# EAGLE design Esquema 02 guilherme (EAGLE 9.6.2)
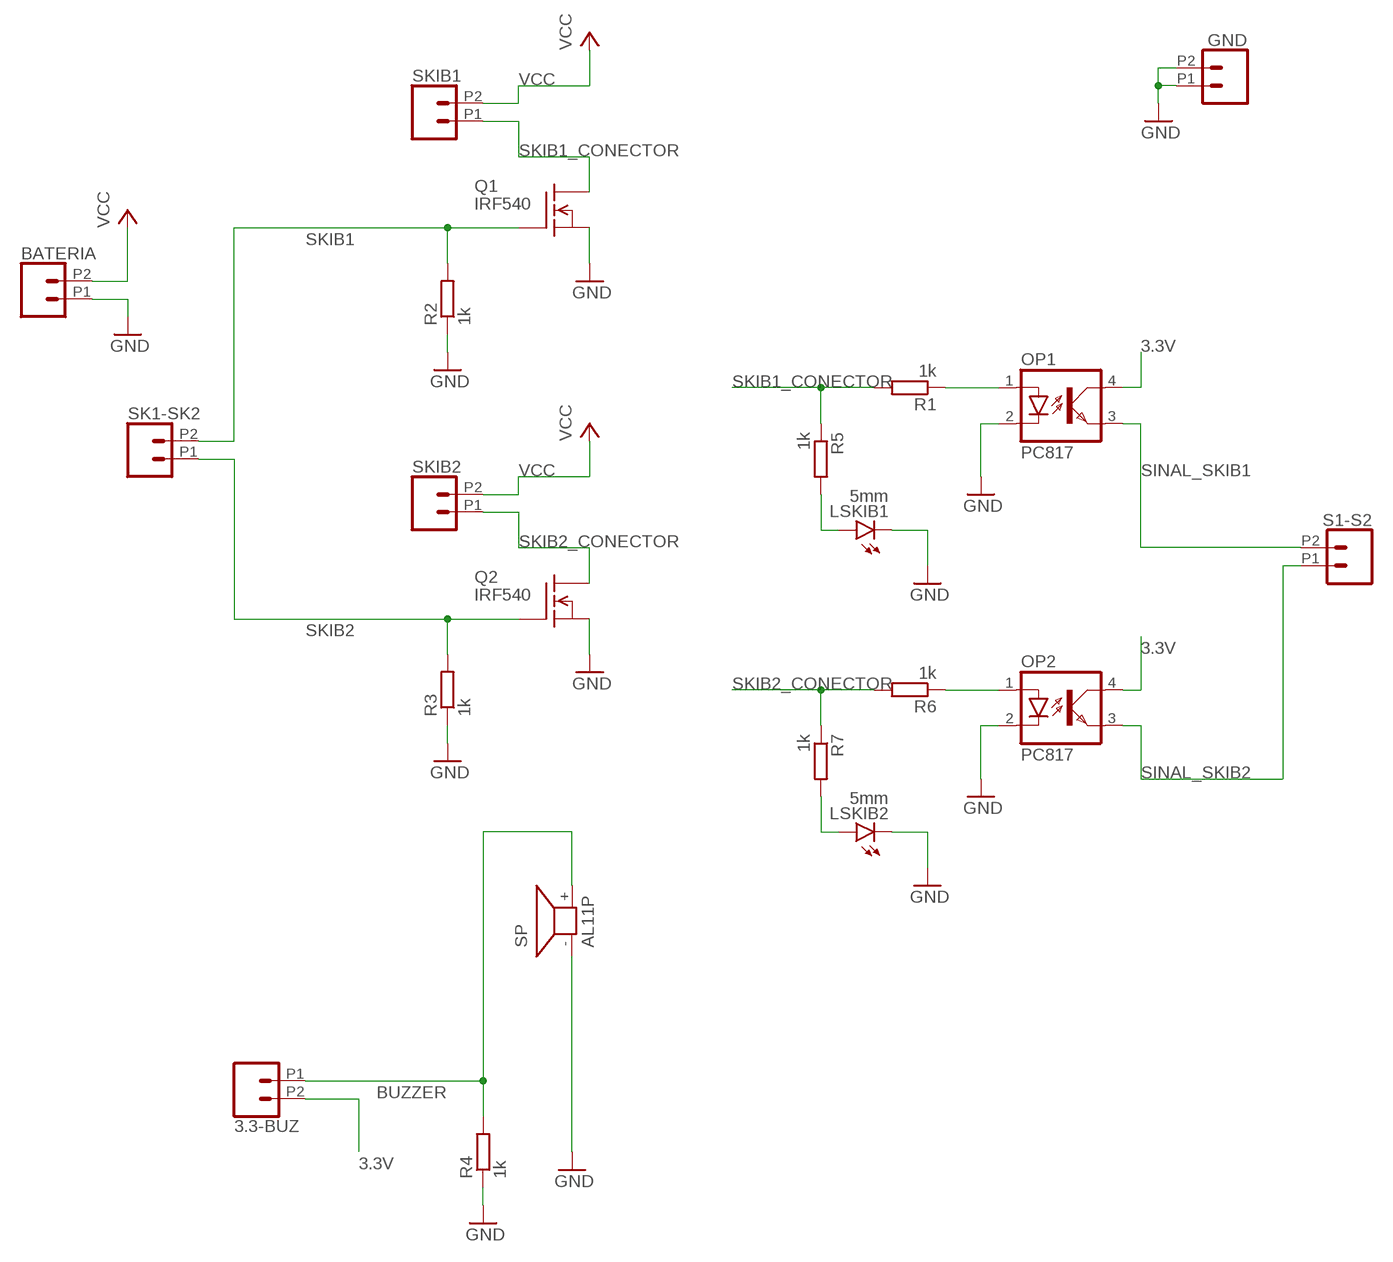
[diagram p0: schematic, sheet 1]

## Parts
3.3-BUZ  CONN_022.54MM_SCREWTERM  [1X02_2.54_SCREWTERM]
BATERIA  CONN_022.54MM_SCREWTERM  [1X02_2.54_SCREWTERM]
GND  CONN_022.54MM_SCREWTERM  [1X02_2.54_SCREWTERM]
LSKIB1  5mm  LED5MM  [LED5MM]
LSKIB2  5mm  LED5MM  [LED5MM]
OP1  PC817  [DIL04]
OP2  PC817  [DIL04]
Q1  IRF540  [TO220]
Q2  IRF540  [TO220]
R1  1k  R-EU_0207/10  [0207/10]
R2  1k  R-EU_0207/10  [0207/10]
R3  1k  R-EU_0207/10  [0207/10]
R4  1k  R-EU_0207/10  [0207/10]
R5  1k  R-EU_0207/10  [0207/10]
R6  1k  R-EU_0207/10  [0207/10]
R7  1k  R-EU_0207/10  [0207/10]
S1-S2  CONN_022.54MM_SCREWTERM  [1X02_2.54_SCREWTERM]
SK1-SK2  CONN_022.54MM_SCREWTERM  [1X02_2.54_SCREWTERM]
SKIB1  CONN_022.54MM_SCREWTERM  [1X02_2.54_SCREWTERM]
SKIB2  CONN_022.54MM_SCREWTERM  [1X02_2.54_SCREWTERM]
SP  AL11P  [AL11P]

## Nets
3.3V: 3.3-BUZ.P2 OP1.4(COL) OP2.4(COL)
BUZZER: 3.3-BUZ.P1 R4.2 SP.+
GND: BATERIA.P1 GND.P1 GND.P2 LSKIB1.K(C) LSKIB2.K(C) OP1.2(C) OP2.2(C) Q1.3(S) Q2.3(S) R2.1 R3.1 R4.1 SP.-
N$1: LSKIB2.A R7.2
N$3: LSKIB1.A R5.2
N$4: OP1.1(A) R1.1
N$5: OP2.1(A) R6.1
SINAL_SKIB1: OP1.3(EMIT) S1-S2.P2
SINAL_SKIB2: OP2.3(EMIT) S1-S2.P1
SKIB1: Q1.1(G) R2.2 SK1-SK2.P2
SKIB1_CONECTOR: Q1.2(D) R1.2 R5.1 SKIB1.P1
SKIB2: Q2.1(G) R3.2 SK1-SK2.P1
SKIB2_CONECTOR: Q2.2(D) R6.2 R7.1 SKIB2.P1
VCC: BATERIA.P2 SKIB1.P2 SKIB2.P2

## Library data of the parts
3.3-BUZ BATERIA GND S1-S2 SK1-SK2 SKIB1 SKIB2 = SparkFun-Connectors:CONN_02: Multi connection point. Often used as Generic Header-pin footprint for 0.1 inch spaced/style header connections On any of the 0.1 inch spaced packages, you can populate with these: Break Away Headers - Straight <https://www.sparkfun.com/products/116> (PRT-00116) Break Away Male Headers - Right Angle <https://www.sparkfun.com/products/553> (PRT-00553) Female Headers <https://www.sparkfun.com/products/115> (PRT-00115) Break Away Headers - Machine Pin <https://www.sparkfun.com/products/117> (PRT-00117) Break Away Female Headers - Swiss Machine Pin <https://www.sparkfun.com/products/743> (PRT-00743) For SCREWTERMINALS and SPRING TERMINALS visit here: Screw Terimnals on SparkFun.com <https://www.sparkfun.com/search/results?term=Screw+Terminals> (5mm/3.5mm/2.54mm spacing) This device is also useful as a general connection point to wire up your design to another part of your project. Our various solder wires solder well into these plated through hole pads. Hook-Up Wire - Assortment (Stranded, 22 AWG) <https://www.sparkfun.com/products/11375> (PRT-11375) Hook-Up Wire - Assortment (Solid Core, 22 AWG) <https://www.sparkfun.com/products/11367> (PRT-11367) View the entire wire category on our website here <https://www.sparkfun.com/categories/141> Special notes: Molex polarized connector foot print use with: PRT-08233 with associated crimp pins and housings. 2.54_SCREWTERM for use with PRT-10571. 3.5mm Screw Terminal footprints for PRT-08084 5mm Screw Terminal footprints for use with PRT-08432
LSKIB1 LSKIB2 = led:LED: LED OSRAM: - CHIPLED LG R971, LG N971, LY N971, LG Q971, LY Q971, LO R971, LY R971 LH N974, LH R974 LS Q976, LO Q976, LY Q976 LO Q996 - Hyper CHIPLED LW Q18S LB Q993, LB Q99A, LB R99A - SideLED LS A670, LO A670, LY A670, LG A670, LP A670 LB A673, LV A673, LT A673, LW A673 LH A674 LY A675 LS A676, LA A676, LO A676, LY A676, LW A676 LS A679, LY A679, LG A679 - Hyper Micro SIDELED® LS Y876, LA Y876, LO Y876, LY Y876 LT Y87S - SmartLED LW L88C, LW L88S LB L89C, LB L89S, LG L890 LS L89K, LO L89K, LY L89K LS L896, LA L896, LO L896, LY L896 - TOPLED LS T670, LO T670, LY T670, LG T670, LP T670 LSG T670, LSP T670, LSY T670, LOP T670, LYG T670 LG T671, LOG T671, LSG T671 LB T673, LV T673, LT T673, LW T673 LH T674 LS T676, LA T676, LO T676, LY T676, LB T676, LH T676, LSB T676, LW T676 LB T67C, LV T67C, LT T67C, LS T67K, LO T67K, LY T67K, LW E67C LS E67B, LA E67B, LO E67B, LY E67B, LB E67C, LV E67C, LT E67C LW T67C LS T679, LY T679, LG T679 LS T770, LO T770, LY T770, LG T770, LP T770 LB T773, LV T773, LT T773, LW T773 LH T774 LS E675, LA E675, LY E675, LS T675 LS T776, LA T776, LO T776, LY T776, LB T776 LHGB T686 LT T68C, LB T68C - Hyper Mini TOPLED® LB M676 - Mini TOPLED Santana® LG M470 LS M47K, LO M47K, LY M47K Source: http://www.osram.convergy.de LUXEON: - LUMILED® LXK2-PW12-R00, LXK2-PW12-S00, LXK2-PW14-U00, LXK2-PW14-V00 LXK2-PM12-R00, LXK2-PM12-S00, LXK2-PM14-U00 LXK2-PE12-Q00, LXK2-PE12-R00, LXK2-PE12-S00, LXK2-PE14-T00, LXK2-PE14-U00 LXK2-PB12-K00, LXK2-PB12-L00, LXK2-PB12-M00, LXK2-PB14-N00, LXK2-PB14-P00, LXK2-PB14-Q00 LXK2-PR12-L00, LXK2-PR12-M00, LXK2-PR14-Q00, LXK2-PR14-R00 LXK2-PD12-Q00, LXK2-PD12-R00, LXK2-PD12-S00 LXK2-PH12-R00, LXK2-PH12-S00 LXK2-PL12-P00, LXK2-PL12-Q00, LXK2-PL12-R00 Source: www.luxeon.com KINGBRIGHT: KA-3528ASYC Source: www.kingbright.com
OP1 OP2 = optocoupler:PC817: SHARP OPTO COUPLER; MPN: PC817X4J000F; OC_FARNELL: 9707727; OC_NEWARK: 97K7059
Q1 Q2 = transistor-fet:IRF540: N-Channel Enhancement MOSFET (HEXFET); 100V; 28A; 0,077Ohm
R1-R7 = rcl:R-EU_: RESISTOR, European symbol; SPICEPREFIX: R
SP = buzzer:AL11P: SPEAKER Source: Buerklin; OC_FARNELL: unknown; OC_NEWARK: unknown

## Board
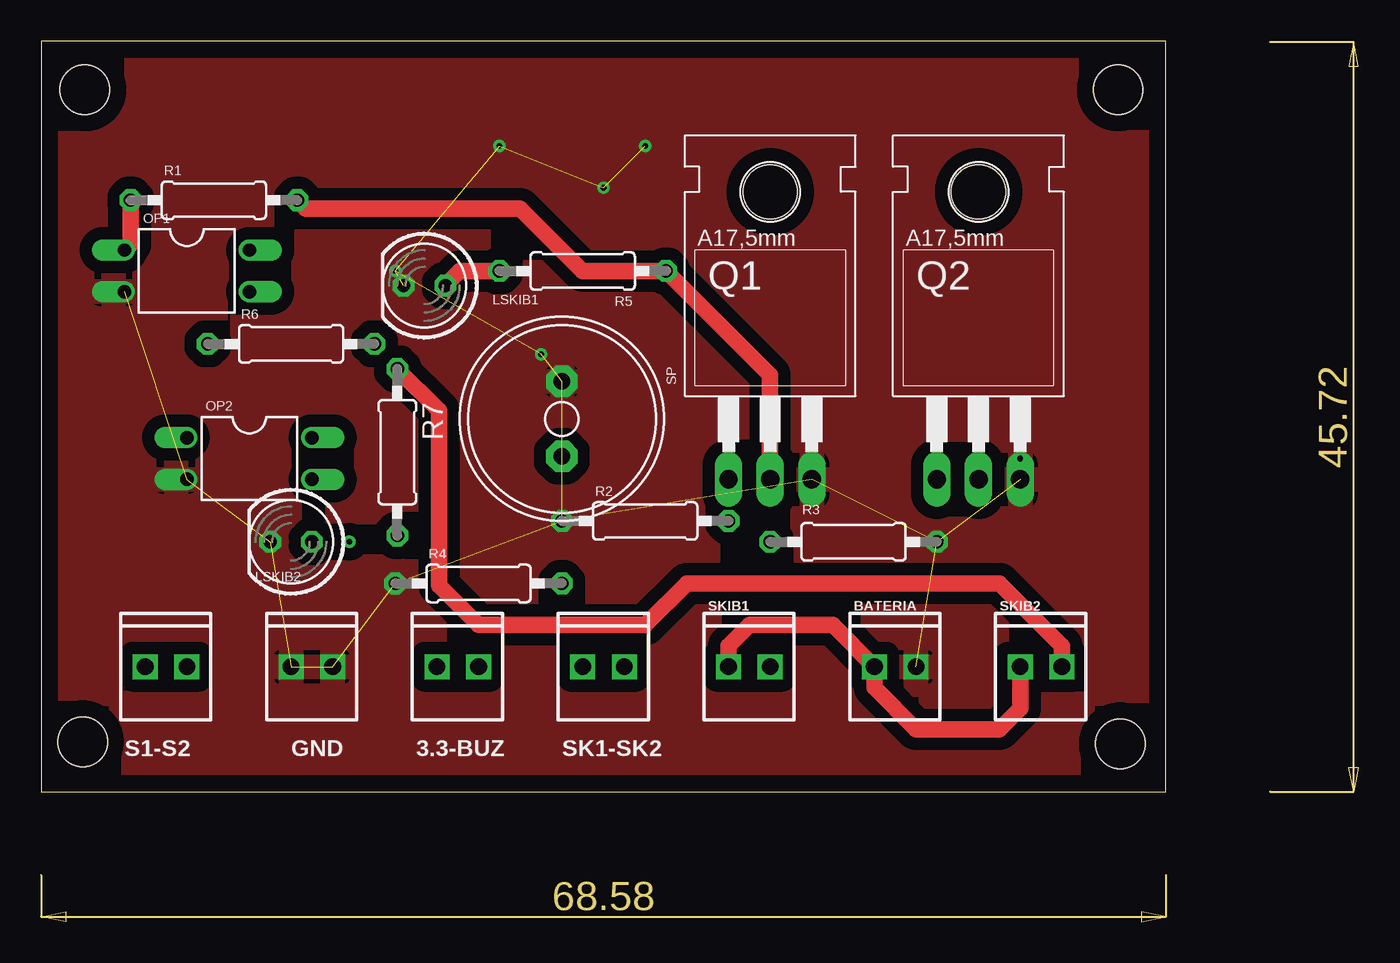
[diagram p1: board, top side]
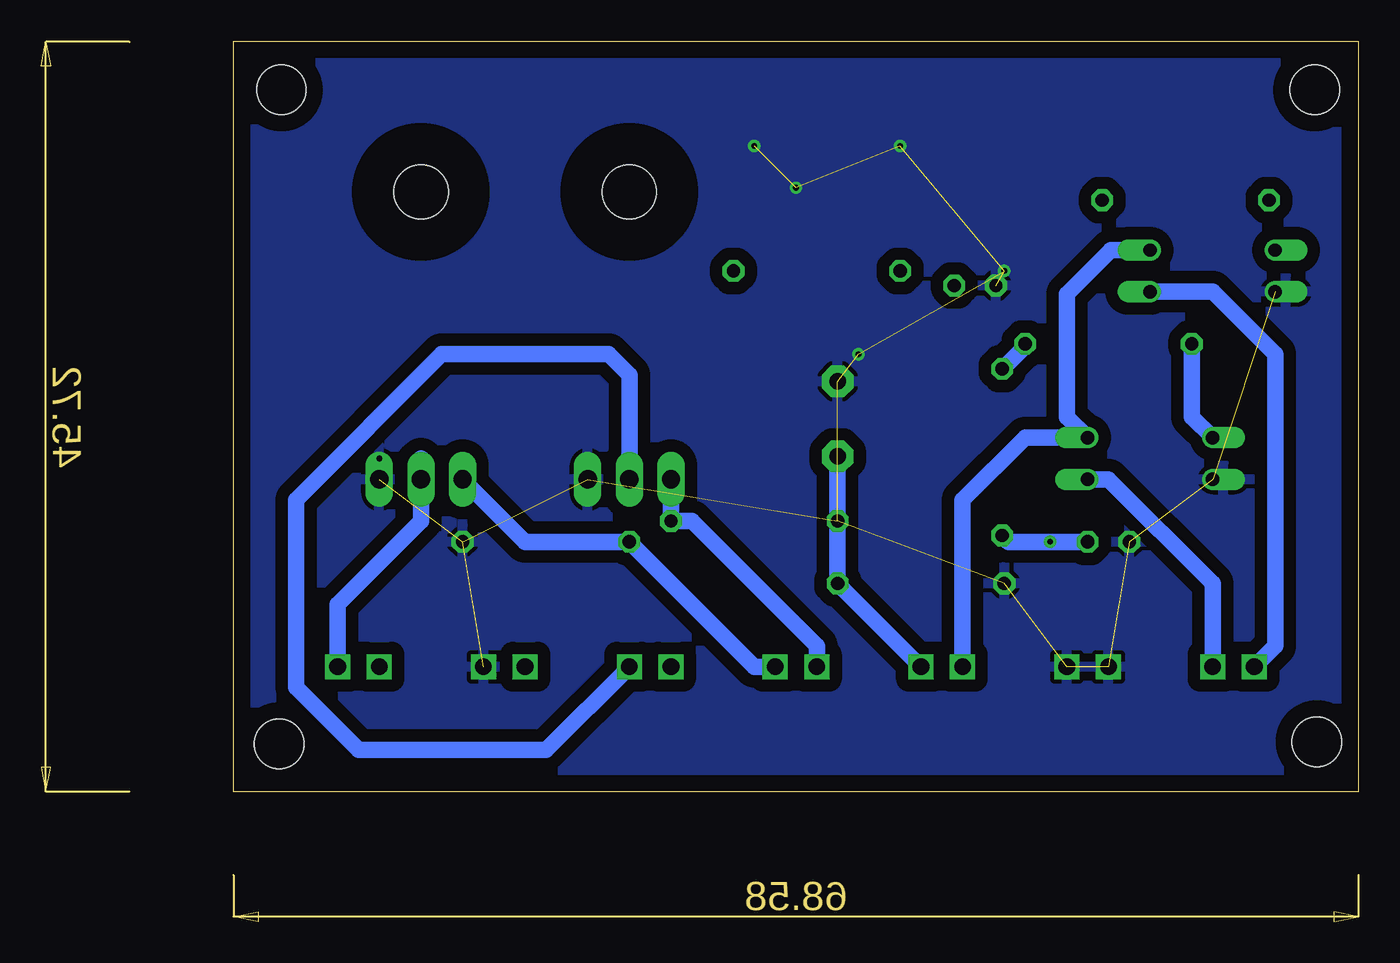
[diagram p2: board, bottom side, seen from below]

Size 68.56 x 45.77 mm. Coordinates in mm from the lower left corner, seen from the top.
Outline: 0,0 68.56,0 68.56,45.77 0,45.77 0,0
Copper layers (1*16): Top 0.035mm / dielectric 1.5mm / Bottom 0.035mm
Design rules "default *": minimum track width 1mm, minimum drill 0.35mm, track to track 30mil, track to pad 0.5mm, pad to pad 6mil, via to via 6mil, smd to smd 6mil, copper to edge 40mil, drill to drill 6mil, minimum pad ring 10mil, minimum via ring 8mil, stop-mask expansion 4mil, vias tented up to drill 1mm, thermal gap 10mil
Holes 3 mm at 2.67,42.8 65.66,42.8 2.54,3.05 65.79,2.92

### Footprints (pad centres in the part's own frame; a part is rotated, then mirrored left to right if it is on the bottom)
1X02_2.54_SCREWTERM = drill 1.016 square: P1 2.54,0; P2 0,0
LED5MM = drill 0.813 octagon: A -1.27,0; K 1.27,0
DIL04 = drill 0.813 offset: 1 -1.27,-3.81; 2 1.27,-3.81; 3 1.27,3.81; 4 -1.27,3.81
TO220 = drill 1.118 long: 1 -2.54,-6.35; 2 0,-6.35; 3 2.54,-6.35 | hole 3.302: 0,11.176
0207/10 = drill 0.813 octagon: 1 -5.08,0; 2 5.08,0
AL11P = drill 1.016 pad 1.905 octagon: + 2.286,0; - -2.286,0

### Placement (x,y rotation side)
3.3-BUZ  24.13,7.62 0 top
BATERIA  50.8,7.62 0 top
GND  15.24,7.62 0 top
LSKIB1  23.37,30.86 180 top
LSKIB2  15.24,15.24 180 top
OP1  8.89,31.75 270 top
OP2  12.7,20.32 270 top
Q1  44.45,25.4 0 top
Q2  57.15,25.4 0 top
R1  10.54,36.07 0 top
R2  36.83,16.51 0 top
R3  49.53,15.24 180 top
R4  26.67,12.7 0 top
R5  33.02,31.75 180 top
R6  15.24,27.3 0 top
R7  21.72,20.7 270 top
S1-S2  6.35,7.62 0 top
SK1-SK2  33.02,7.62 0 top
SKIB1  41.91,7.62 0 top
SKIB2  59.69,7.62 0 top
SP  31.75,22.73 270 top

### Tracks (layer width: path | path; a pad name or v marks a point on that pad's centre or on a via)
3.3V
  Bottom 1: OP1.4 15.1,33.02 17.78,30.34 17.78,22.86 OP2.4 20.32,21.59 24.13,17.78 3.3-BUZ.P2
BUZZER
  Bottom 1: SP.+ R4.2 3.3-BUZ.P1
GND  (via drill 0.35)  (17 unrouted)
  other vias: 15.24,7.62 17.78,7.62 5.08,30.48 21.59,31.75 27.94,39.37 36.83,39.37 30.48,26.67 34.29,36.83 59.69,20.32 31.75,16.51 5.08,30.48
  pour Bottom: 0.38,45.34 0.38,0.38 68.2,0.38 68.2,45.34
  pour Top: 0,45.72 68.58,45.72 68.58,0 0,0
N$1  (via drill 0.35)
  Bottom 1: R7.2 21.34,15.24 v18.8,15.24 LSKIB2.A
N$3
  Top 1: R5.2 25.53,31.75 LSKIB1.A
N$4
  Top 1: R1.1 5.46,33.4 OP1.1
N$5
  Bottom 1: R6.1 10.16,22.86 OP2.1
SINAL_SKIB1
  Bottom 1: S1-S2.P2 5.08,8.89 5.08,26.67 8.89,30.48 OP1.3
SINAL_SKIB2
  Bottom 1: OP2.3 15.24,19.05 8.89,12.7 S1-S2.P1
SKIB1
  Bottom 1: R2.2 40.64,16.51 33.02,8.89 SK1-SK2.P2
  Bottom 1.016: Q1.1 R2.2
SKIB1_CONECTOR
  Top 1: Q1.2 44.45,25.4 R5.1 33.02,31.75 29.21,35.56 16.13,35.56 R1.2
  Bottom 1: Q1.2 44.45,25.4 45.72,26.67 55.88,26.67 64.77,17.78 64.77,6.35 60.96,2.54 49.53,2.54 SKIB1.P1
SKIB2
  Bottom 1: SK1-SK2.P1 36.83,7.62 R3.2 50.8,15.24 Q2.1
SKIB2_CONECTOR
  Top 1: R7.1 24.26,23.24 24.26,12.57 26.67,10.16 36.83,10.16 39.37,12.7 58.42,12.7 62.23,8.89 SKIB2.P1
  Bottom 1: R7.1 20.32,27.18 R6.2 | 57.15,20.32 Q2.2 57.15,16.51 62.23,11.43 SKIB2.P1
VCC
  Top 1: BATERIA.P2 50.71,7.71 | BATERIA.P2 50.8,6.35 53.34,3.81 58.42,3.81 59.69,5.08 SKIB2.P2 | BATERIA.P2 48.26,10.16 43.18,10.16 41.91,8.89 SKIB1.P2